# EAGLE design RS485_ISO_Sensor_unit (EAGLE 9.6.2)
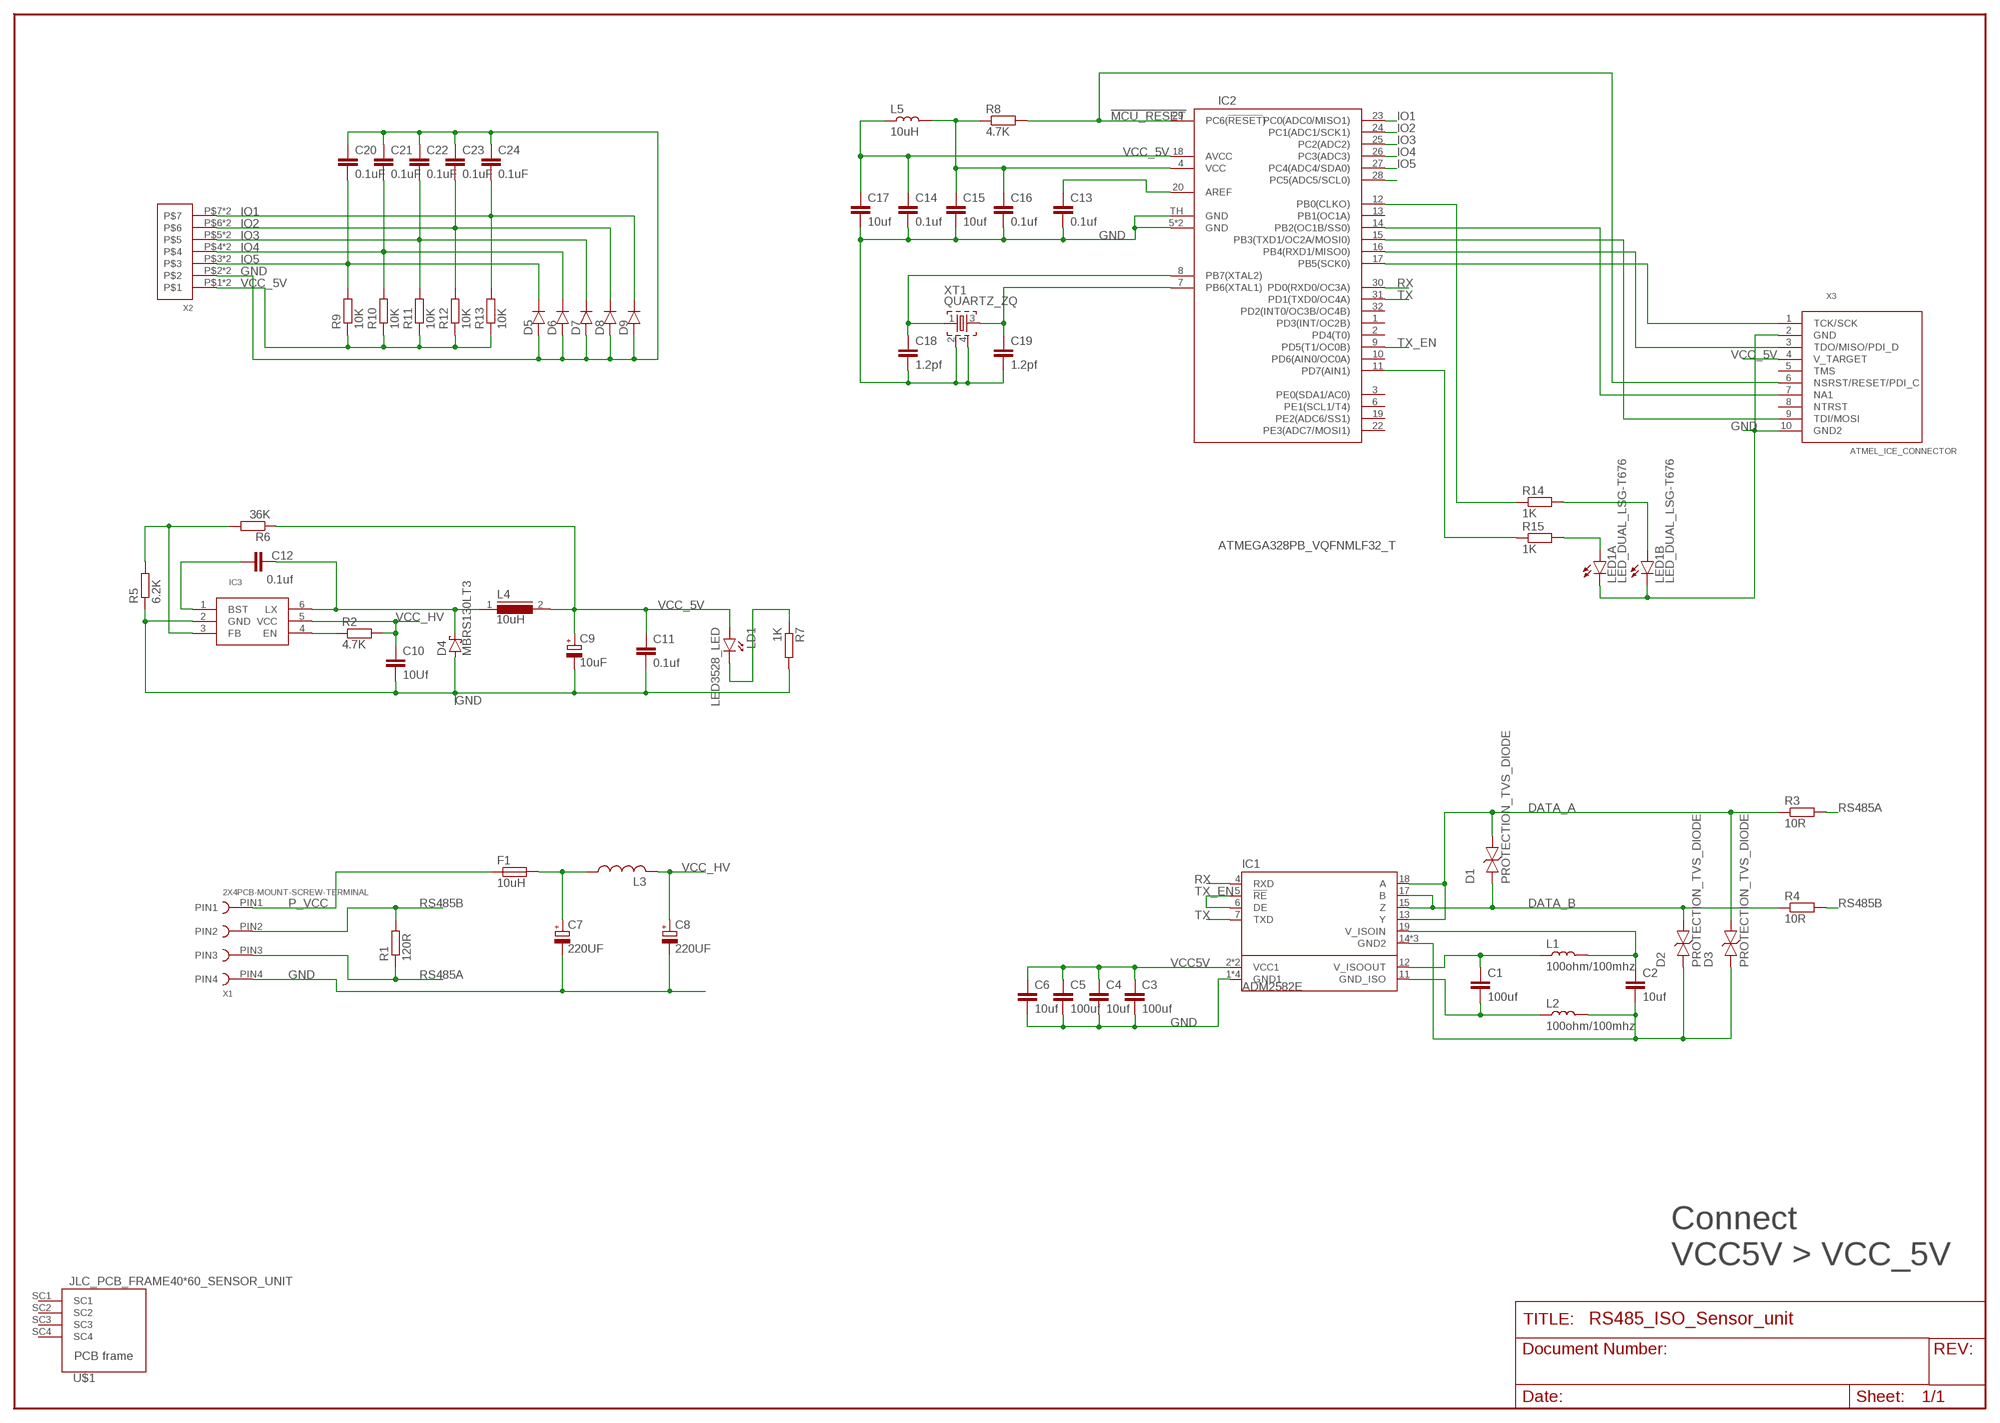
[diagram p0: schematic, sheet 1]

## Parts
C1  100uf  SMD_C0603  [0603]
C2  10uf  SMD_C0603  [0603]
C3  100uf  SMD_C0603  [0603]
C4  10uf  SMD_C0603  [0603]
C5  100uf  SMD_C0603  [0603]
C6  10uf  SMD_C0603  [0603]
C7  220UF  RADIAL_330UF_25V_8MM  [3.6MM]
C8  220UF  RADIAL_330UF_25V_8MM  [3.6MM]
C9  10uF  TANTAL_686_7343  [D/7343-31R]
C10  10Uf  SMD_C1206  [1206]
C11  0.1uf  SMD_C0603  [0603]
C12  0.1uf  SMD_C0603  [0603]
C13  0.1uf  SMD_C0603  [0603]
C14  0.1uf  SMD_C0603  [0603]
C15  10uf  SMD_C3528  [3528]
C16  0.1uf  SMD_C0603  [0603]
C17  10uf  SMD_C3528  [3528]
C18  1.2pf  SMD_C0603  [0603]
C19  1.2pf  SMD_C0603  [0603]
C20  0.1uF  SMD_C0603  [0603]
C21  0.1uF  SMD_C0603  [0603]
C22  0.1uF  SMD_C0603  [0603]
C23  0.1uF  SMD_C0603  [0603]
C24  0.1uF  SMD_C0603  [0603]
D1  PROTECTION_TVS_DIODE  [SMA403D]
D2  PROTECTION_TVS_DIODE  [SMA403D]
D3  PROTECTION_TVS_DIODE  [SMA403D]
D4  MBRS130LT3  [SMB]
D5  L1N4148WT1GSOD123_GALILE0_SMALL  [SOD-123_MINI-SMA]
D6  L1N4148WT1GSOD123_GALILE0_SMALL  [SOD-123_MINI-SMA]
D7  L1N4148WT1GSOD123_GALILE0_SMALL  [SOD-123_MINI-SMA]
D8  L1N4148WT1GSOD123_GALILE0_SMALL  [SOD-123_MINI-SMA]
D9  L1N4148WT1GSOD123_GALILE0_SMALL  [SOD-123_MINI-SMA]
F1  10uH  SMD_FUSE  [SMD_2410_FUSE_NOK]
IC1  ADM2582E  [SO20L]
IC2  ATMEGA328PB_VQFNMLF32_T  [MLF32-TH]
IC3  BD9G101G_SOT23(6)  [SOT-23(6)]
L1  100ohm/100mhz  SMD_L  [0805]
L2  100ohm/100mhz  SMD_L  [0805]
L3  L-US0207/2V  [0207/2V]
L4  10uH  DR74  [DR74]
L5  10uH  SMD_L  [0805]
LD1  LED3528_LED  [3528]
LED1  LED_DUAL_LSG-T676  [P-LCC4-0]
R1  120R  R-EU_0204/5  [0204/5]
R2  4.7K  SMD_R0603  [0603]
R3  10R  SMD_R1206  [1206]
R4  10R  SMD_R1206  [1206]
R5  6.2K  SMD_R0603  [0603]
R6  36K  SMD_R0603  [0603]
R7  1K  SMD_R0603  [0603]
R8  4.7K  SMD_R0603  [0603]
R9  10K  SMD_R0603  [0603]
R10  10K  SMD_R0603  [0603]
R11  10K  SMD_R0603  [0603]
R12  10K  SMD_R0603  [0603]
R13  10K  SMD_R0603  [0603]
R14  1K  SMD_R0603  [0603]
R15  1K  SMD_R0603  [0603]
U$1  JLC_PCB_FRAME40*60_SENSOR_UNIT  [40X60_SENSOR_UNIT]
X1  2X4PCB-MOUNT-SCREW-TERMINAL  [2X4PCB-MOUNT-SCREW-TERMINAL]
X2  WAGO250_X7  [WAGO250_FP_7X]
X3  ATMEL_ICE_CONNECTOR  [MINI10P_SPI/JTAG/PDI]
XT1  QUARTZ_ZQ  [QUARTZ_3X3MM]

## Nets
!MCU_RESET: IC2.29(PC6(!RESET!)) R8.2 X3.6(NSRST/RESET/PDI_C)
AREF: C13.1 IC2.20(AREF)
AVCC: C14.1 C17.M IC2.18(AVCC) L5.1
DATA_A: D1.P$2(C) D3.P$2(C) IC1.13(Y) IC1.18(A) R3.1
DATA_B: D1.P$1(A) D2.P$2(C) IC1.15(Z) IC1.17(B) R4.1
GND: C3.2 C4.2 C5.2 C6.2 C7.P$1(-) C8.P$1(-) C9.- C10.2 C11.2 C13.2 C14.2 C15.P C16.2 C17.P C18.2 C19.2 C20.1 C21.1 C22.1 C23.1 C24.1 D4.A D5.A D6.A D7.A D8.A D9.A IC1.1(GND1) IC1.3(GND1) IC1.9(GND1) IC1.10(GND1) IC2.5(GND) IC2.21(GND) IC2.TH(GND) IC3.2(GND) LED1.1(A:C) LED1.3(B:C) R5.1 R7.2 X1.PIN4 X2.P$2 X2.U$2 X3.2(GND) X3.10(GND2) XT1.2 XT1.4
GND2: C2.2 D2.P$1(A) D3.P$1(A) IC1.14(GND2) IC1.16(GND2) IC1.20(GND2) L2.2
IO1: C24.2 D9.C IC2.23(PC0(ADC0/MISO1)) R13.2 X2.P$7 X2.U$7
IO2: C23.2 D8.C IC2.24(PC1(ADC1/SCK1)) R12.2 X2.P$6 X2.U$6
IO3: C22.2 D7.C IC2.25(PC2(ADC2)) R11.2 X2.P$5 X2.U$5
IO4: C21.2 D6.C IC2.26(PC3(ADC3)) R10.2 X2.P$4 X2.U$4
IO5: C20.2 D5.C IC2.27(PC4(ADC4/SDA0)) R9.2 X2.P$3 X2.U$3
N$1: C7.P$2(+) F1.P$2 L3.1
N$2: IC3.4(EN) R2.1
N$3: C1.1 IC1.12(V_ISOOUT) L1.1
N$4: C2.1 IC1.19(V_ISOIN) L1.2
N$5: C1.2 IC1.11(GND_ISO) L2.1
N$6: C12.1 IC3.1(BST)
N$7: IC3.3(FB) R5.2 R6.2
N$8: C12.2 D4.C IC3.6(LX) L4.1
N$9: LED1.2(A:A) R15.2
N$10: LED1.4(B:A) R14.2
N$11: IC2.12(PB0(CLKO)) R14.1
N$12: LD1.M(K) R7.1
N$13: IC2.17(PB5(SCK0)) X3.1(TCK/SCK)
N$14: IC2.16(PB4(RXD1/MISO0)) X3.3(TDO/MISO/PDI_D)
N$15: IC2.15(PB3(TXD1/OC2A/MOSI0)) X3.9(TDI/MOSI)
N$16: IC2.11(PD7(AIN1)) R15.1
N$17: IC2.14(PB2(OC1B/SS0)) X3.7(NA1)
N$18: C18.1 IC2.8(PB7(XTAL2)) XT1.1
N$19: C19.1 IC2.7(PB6(XTAL1)) XT1.3
N$23: IC2.28(PC5(ADC5/SCL0))
P_VCC: F1.P$1 X1.PIN1
RS485A: R1.1 R3.2 X1.PIN3
RS485B: R1.2 R4.2 X1.PIN2
RX: IC1.4(RXD) IC2.30(PD0(RXD0/OC3A))
TX: IC1.7(TXD) IC2.31(PD1(TXD0/OC4A))
TX_EN: IC1.5(!RE) IC1.6(DE) IC2.9(PD5(T1/OC0B))
VCC5V: C3.1 C4.1 C5.1 C6.1 IC1.2(VCC1) IC1.8(VCC1)
VCC_5V: C9.+ C11.1 C15.M C16.1 IC2.4(VCC) L4.2 L5.2 LD1.P(A) R6.1 R8.1 R9.1 R10.1 R11.1 R12.1 R13.1 X2.P$1 X2.U$1 X3.4(V_TARGET)
VCC_HV: C8.P$2(+) C10.1 IC3.5(VCC) L3.2 R2.2
Unconnected: IC2.1(PD3(INT/OC2B)) IC2.2(PD4(T0)) IC2.3(PE0(SDA1/AC0)) IC2.6(PE1(SCL1/T4)) IC2.10(PD6(AIN0/OC0A)) IC2.13(PB1(OC1A)) IC2.19(PE2(ADC6/SS1)) IC2.22(PE3(ADC7/MOSI1)) IC2.32(PD2(INT0/OC3B/OC4B)) U$1.SC1 U$1.SC2 U$1.SC3 U$1.SC4 X3.5(TMS) X3.8(NTRST)

## Notes on the sheet
- Connect 
  VCC5V > VCC_5V

## Library data of the parts
C1-C6 C10-C24 = passive_components:SMD_C
C7 C8 = passive_components:RADIAL_330UF_25V_8MM
C9 = passive_components:TANTAL_686_7343
D1-D3 = passive_components:PROTECTION_TVS_DIODE
D4 = diode:MBRS130LT3: Schottky Power Rectifier Source: http://www.onsemi.com/pub/Collateral/MBRS130LT3-D.PDF
D5-D9 = passive_components:L1N4148WT1G
F1 = passive_components:SMD_FUSE
IC1 = my_IC:ADM2582E
IC2 = my_IC:ATMEGA328PB_VQFN
IC3 = my_IC:BD9G101G_SOT23(6)
L1 L2 L5 = passive_components:SMD_L
L3 = rcl:L-US: INDUCTOR, American symbol
L4 = inductors:DR74: High Power Density, High Efficiency, Shielded Inductors Source: coiltronics_dr_series.pdf; SPICEPREFIX: L
LD1 = passive_components:LED
LED1 = passive_components:LED_DUAL_LSG-T676: LSG T676 Hyper Multi TOPLED ® Hyper-Bright LED Source: http://docs-europe.electrocomponents.com/webdocs/08c3/0900766b808c36ca.pdf
R1 = rcl:R-EU_: RESISTOR, European symbol
R2-R15 = passive_components:SMD_R
U$1 = passive_components:JLC_PCB_FRAME
X1 = Wago_250:2X4PCB-MOUNT-SCREW-TERMINAL
X2 = Wago_250:WAGO250_X7
X3 = passive_components:ATMEL_ICE_CONNECTOR
XT1 = passive_components:QUARTZ_ZQ

## Board
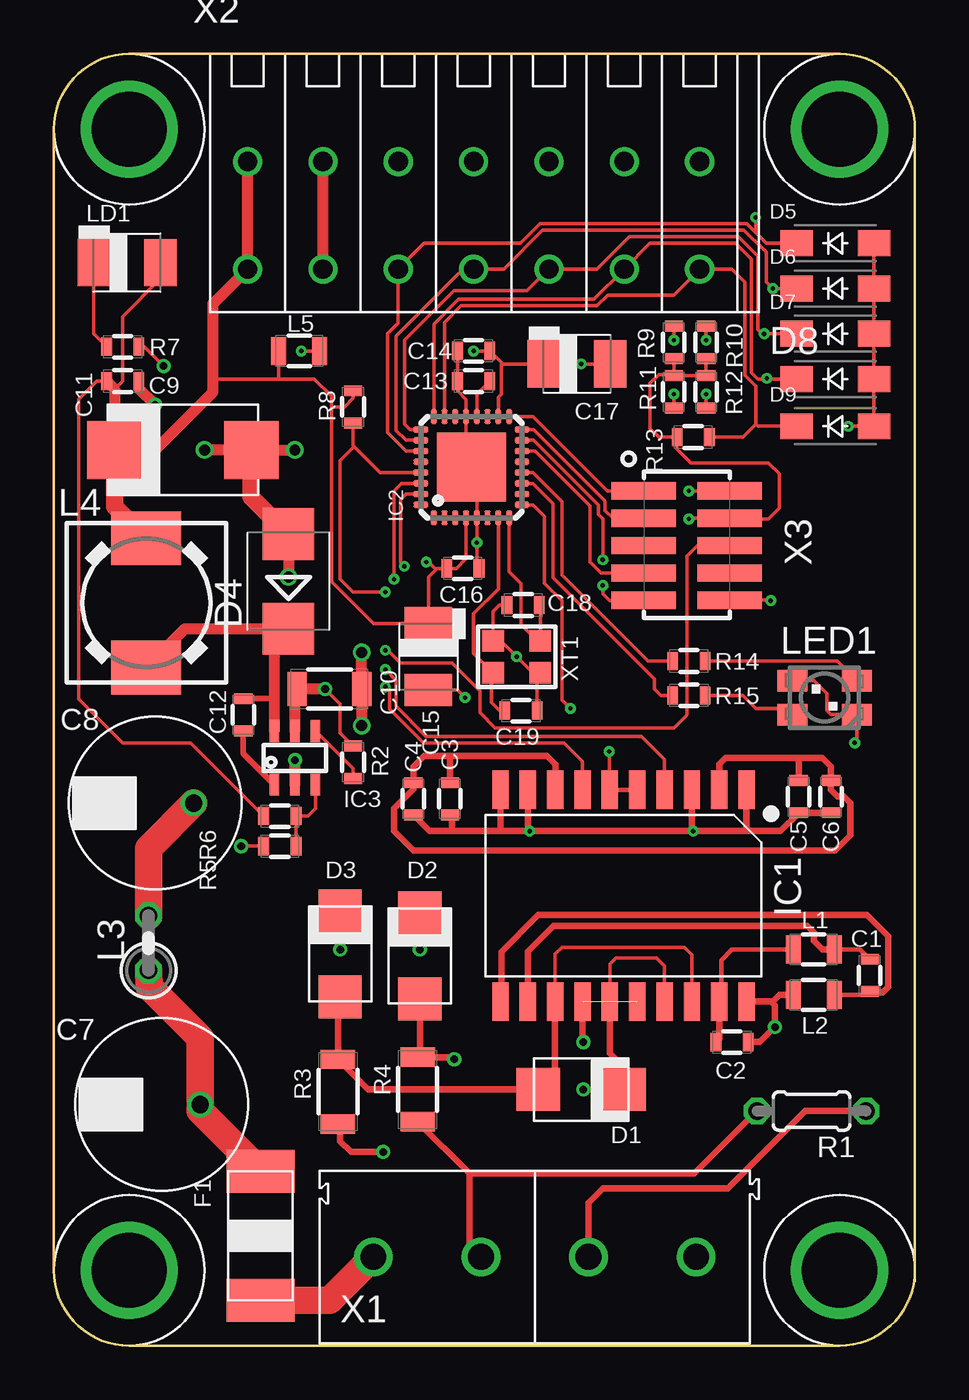
[diagram p1: board, top side]
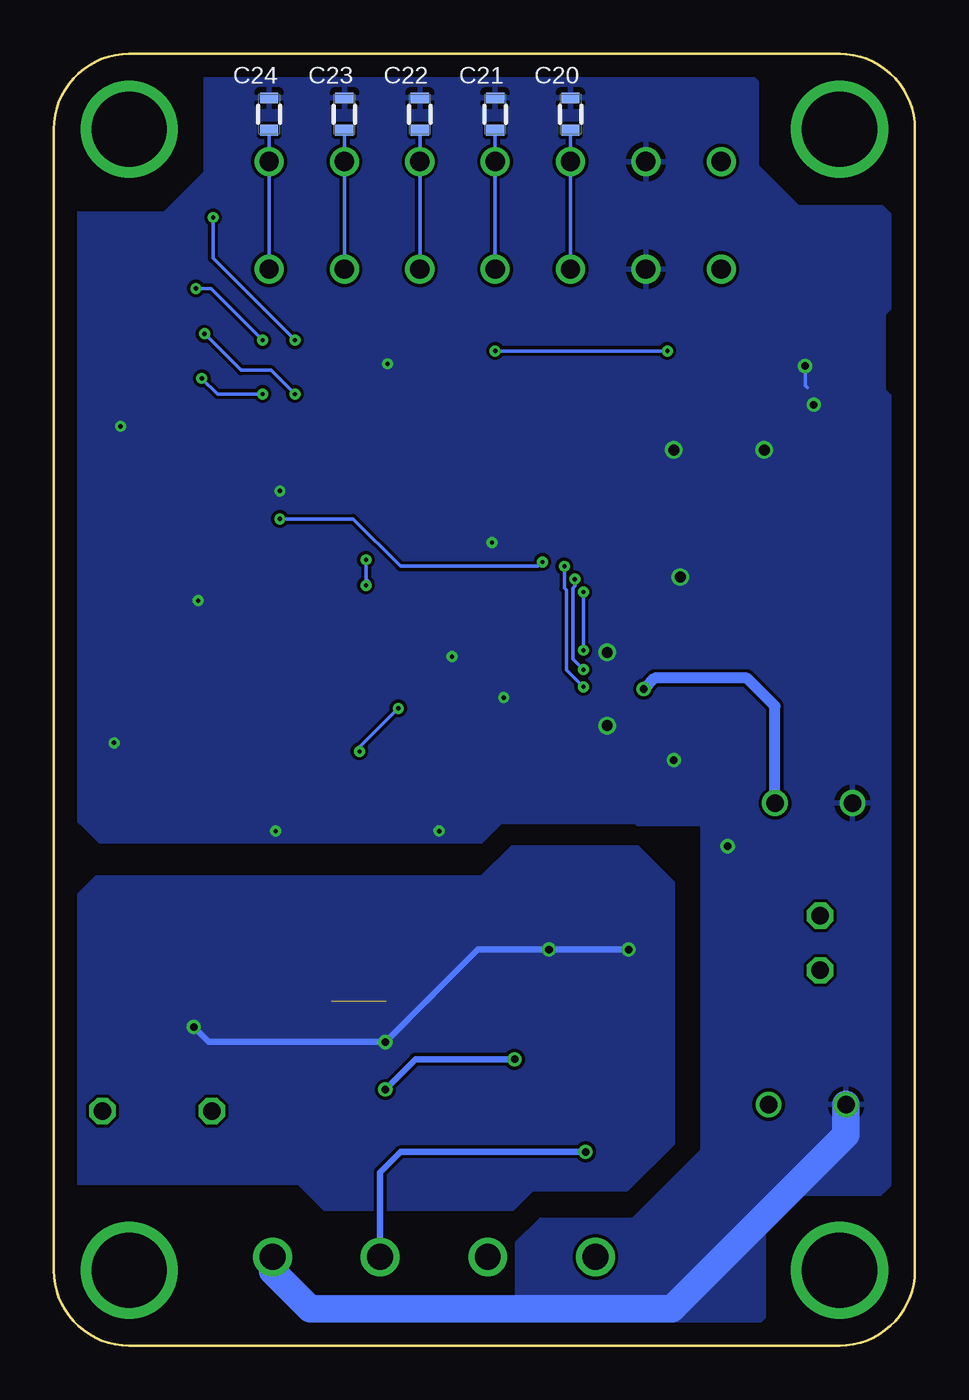
[diagram p2: board, bottom side, seen from below]

Size 40 x 60 mm. Coordinates in mm from the lower left corner, seen from the top.
Copper layers (1*16): Top 0.035mm / dielectric 1.5mm / Bottom 0.035mm
Design rules "default *": minimum track width 6mil, minimum drill 0.2mm, track to track 6mil, track to pad 6mil, pad to pad 6mil, via to via 6mil, smd to smd 6mil, copper to edge 40mil, drill to drill 6mil, minimum pad ring 6mil, minimum via ring 6mil, stop-mask expansion 4mil, vias tented up to drill 20mil, thermal gap 10mil

### Footprints (pad centres in the part's own frame; a part is rotated, then mirrored left to right if it is on the bottom)
0603 = smd 0.85 x 0.5: 1 0,0.75; 2 0,-0.75
3.6MM = drill 0.8: P$1 -1.8,0; P$2 1.8,0
D/7343-31R = smd 2.55 x 2.7: + 3.175,0; - -3.175,0
1206 = smd 1.6 x 0.9: 1 0,1.5; 2 0,-1.5
3528 = smd 1.5 x 2.2: M -1.55,0; P 1.55,0
SMA403D = smd 2 x 2: P$1 -2,0; P$2 2,0
SMB = smd 2.4 x 2.4: A 2.2,0; C -2.2,0
SOD-123_MINI-SMA = smd 1.5 x 1.2: A 1.8,0; C -1.8,0
SMD_2410_FUSE_NOK = smd 2 x 3.15: P$1 -3,0; P$2 3,0
SO20L = smd 0.762 x 1.778: 1 -5.08,-4.915; 2 -3.81,-4.915; 3 -2.54,-4.915; 4 -1.27,-4.915; 5 0,-4.915; 6 1.27,-4.915; 7 2.54,-4.915; 8 3.81,-4.915; 9 5.08,-4.915; 10 6.35,-4.915; 11 6.35,4.915; 12 5.08,4.915; 13 3.81,4.915; 14 2.54,4.915; 15 1.27,4.915; 16 0,4.915; 17 -1.27,4.915; 18 -2.54,4.915; 19 -3.81,4.915; 20 -5.08,4.915
MLF32-TH = smd 0.7 x 0.3: 1 -2.35,1.75; 2 -2.35,1.25; 3 -2.35,0.75; 4 -2.35,0.25; 5 -2.35,-0.25; 6 -2.35,-0.75; 7 -2.35,-1.25; 8 -2.35,-1.75; 17 2.35,-1.75; 18 2.35,-1.25; 19 2.35,-0.75; 20 2.35,-0.25; 21 2.35,0.25; 22 2.35,0.75; 23 2.35,1.25; 24 2.35,1.75 | smd 0.3 x 0.7: 9 -1.75,-2.35; 10 -1.25,-2.35; 11 -0.75,-2.35; 12 -0.25,-2.35; 13 0.25,-2.35; 14 0.75,-2.35; 15 1.25,-2.35; 16 1.75,-2.35; 25 1.75,2.35; 26 1.25,2.35; 27 0.75,2.35; 28 0.25,2.35; 29 -0.25,2.35; 30 -0.75,2.35; 31 -1.25,2.35; 32 -1.75,2.35 | smd 3.2 x 3.2: TH 0,0
SOT-23(6) = smd 0.45 x 1: 1 -0.95,-1.25; 2 0,-1.25; 3 0.95,-1.25; 4 0.95,1.25; 5 0,1.25; 6 -0.95,1.25
0805 = smd 1.3 x 0.7: 1 0,0.95; 2 0,-0.95
0207/2V = drill 0.813 octagon: 1 -1.27,0; 2 1.27,0
DR74 = smd 2.5 x 3.25: 1 -3,0; 2 3,0
P-LCC4-0 = smd 1 x 1.4: 1 -0.787,-1.5; 2 -0.787,1.5; 3 0.787,1.5; 4 0.787,-1.5
0204/5 = drill 0.813 octagon: 1 -2.54,0; 2 2.54,0
40X60_SENSOR_UNIT = drill 3.5: SC1 3.5,56.5; SC2 36.5,56.5; SC3 3.5,3.5; SC4 36.5,3.5
2X4PCB-MOUNT-SCREW-TERMINAL = drill 1.2: PIN1 0,2.5; PIN2 0,-2.5; PIN3 0,-7.5; PIN4 0,-12.5
WAGO250_FP_7X = drill 0.9: P$1 0,5; P$2 3.5,5; P$3 7,5; P$4 10.5,5; P$5 14,5; P$6 17.5,5; P$7 21,5; U$1 0,0; U$2 3.5,0; U$3 7,0; U$4 10.5,0; U$5 14,0; U$6 17.5,0; U$7 21,0
MINI10P_SPI/JTAG/PDI = smd 0.8 x 3: 1 0,-4; 2 0,0; 3 1.27,-4; 4 1.27,0; 5 2.54,-4; 6 2.54,0; 7 3.81,-4; 8 3.81,0; 9 5.08,-4; 10 5.08,0
QUARTZ_3X3MM = smd 1 x 1: 1 -0.75,1.1; 2 0.75,1.1; 3 0.75,-1.1; 4 -0.75,-1.1

### Placement (x,y rotation side)
C1  37.9,17.2 0 top
C2  31.5,14.1 90 top
C3  18.4,25.4 0 top
C4  16.7,25.4 0 top
C5  34.6,25.5 0 top
C6  36.1,25.5 0 top
C7  5,11.2 0 top
C8  4.7,25.2 0 top
C9  6,41.6 180 top
C10  12.8,30.5 90 top
C11  3.2,44.8 90 top
C12  8.8,29.3 180 top
C13  19.5,44.8 270 top
C14  19.5,46.2 270 top
C15  17.4,32 270 top
C16  19,36.1 90 top
C17  24.3,45.6 0 top
C18  21.8,34.4 270 top
C19  21.7,29.5 90 top
C20  16,57.2 0 bottom
C21  19.5,57.2 0 bottom
C22  23,57.2 0 bottom
C23  26.5,57.2 0 bottom
C24  30,57.2 0 bottom
D1  24.5,11.9 180 top
D2  17,18.1 270 top
D3  13.3,18.2 270 top
D4  10.9,35.5 90 top
D5  36.3,51.2 0 top
D6  36.3,49.1 0 top
D7  36.3,47 0 top
D8  36.3,44.9 0 top
D9  36.3,42.7 0 top
F1  9.6,5.1 90 top
IC1  27.1,20.9 180 top
IC2  19.4,40.8 90 top
IC3  11.2,27.3 0 top
L1  35.3,18.4 270 top
L2  35.3,16.3 270 top
L3  4.4,18.7 90 top
L4  4.3,34.5 90 top
L5  11.4,46.2 270 top
LD1  3.4,50.3 0 top
LED1  35.8,30.1 90 top
R1  35.2,10.9 180 top
R2  13.9,27.1 180 top
R3  13.2,11.8 0 top
R4  16.9,11.9 0 top
R5  10.5,23.2 90 top
R6  10.5,24.6 90 top
R7  3.2,46.4 90 top
R8  13.9,43.6 0 top
R9  28.8,46.6 180 top
R10  30.3,46.6 180 top
R11  28.8,44.3 0 top
R12  30.3,44.3 0 top
R13  29.7,42.2 90 top
R14  29.5,31.8 90 top
R15  29.5,30.2 90 top
U$1  0,0 0 top
X1  17.34,4.12 90 top
X2  9,50 0 top
X3  31.4,39.7 270 top
XT1  21.5,32 270 top

### Tracks (layer width: path | path; a pad name or v marks a point on that pad's centre or on a via)
!MCU_RESET  (via drill 0.2 pad 0.35)
  Top 0.152: IC2.29 15.15,40.55 13.95,41.75 | 13.95,41.75 13.9,41.8 R8.2 | v15.4,32.3 15.5,32.3 16.1,31.7 18.5,31.7 19.8,30.4 19.8,29.4 20.5,28.7 28.81,28.7 29.41,29.3 29.41,36.67 29.9,37.16 X3.6 | v15.4,35 13.9,35 13.3,35.6 13.3,41.1 13.95,41.75
  Bottom 0.152: v15.4,32.3 v15.4,35
AREF
  Top 0.152: IC2.20 19.65,44.2 C13.1
AVCC  (via drill 0.2 pad 0.35)
  Top 0.152: IC2.18 20.65,44.05 20.8,44.2 20.8,45.65 | 20.8,45.65 C14.1 v19.5,46.2 | C17.M 20.85,45.6 20.8,45.65 | L5.1 v11.5,46.2
  Bottom 0.152: 19.4,46.1 v19.5,46.2 v11.5,46.2
DATA_A
  Top 0.152: IC1.13 23.29,18.19 23.6,18.5 29.3,18.5 29.64,18.16 IC1.18
  Top 0.305: IC1.13 23.29,12.69 D1.P$2 14.6,11.9 R3.1 13.2,16.1 D3.P$2
DATA_B  (via drill 0.35)
  Top 0.152: IC1.15 25.83,17.73 26.1,18 28,18 28.37,17.63 IC1.17
  Top 0.305: IC1.15 25.83,13.57 26.5,12.9 D1.P$1 v24.6,11.9 | D2.P$2 17,13.5 R4.1 18.5,13.4 v18.6,13.3
  Bottom 0.305: v18.6,13.3 23.2,13.3 v24.6,11.9
GND  (via drill 0.2, 0.2 pad 0.35, 0.35, 0.5)
  Top 0.152: R5.1 v8.7,23.2 | R7.2 4.2,46.4 v5.1,45.5 | C18.2 20.7,34.4 20.4,34.1 XT1.4 20.75,32.75 v21.5,32 22.25,31.25 XT1.2 22.45,31.1 C19.2 | C16.2 19.65,36.2 v19.65,37.3 IC2.5 19.65,40.55 IC2.TH 19.15,41.05 IC2.21 19.15,43.95 18.75,44.35 C13.2 C14.2 | C15.P 18.75,30.45 v19.1,30.1 | C17.P v24.5,45.6 | X3.2 v29.5,39.7 | X3.10 33.28,34.62 v33.3,34.6 | D5.A D6.A D7.A D8.A D9.A v36.9,42.7 | LED1.3 35.31,30.89 35.9,30.3 35.9,29.5 36.09,29.31 LED1.1 37.3,28.1 v37.2,28
  Top 0.305: 32.25,25.89 IC1.1 32.18,24.02 32.3,23.9 | C6.2 C5.2 33.75,23.9 32.3,23.9 | C4.2 17.45,23.9 18.5,23.9 | 32.3,23.9 v29.7,23.9 | v29.7,23.9 v22.1,23.9 | v22.1,23.9 20.8,23.9 | 20.8,23.9 18.5,23.9 | C3.2 18.5,24.55 18.5,23.9 | IC1.10 20.75,23.95 20.8,23.9 | IC1.9 22.02,23.98 v22.1,23.9 | IC1.3 29.64,23.96 v29.7,23.9
  Top 0.508: v14.3,32.2 C10.2 v14.3,28.8 | D4.A v10.9,35.7 | v7,41.6 C9.- v11.2,41.6 | IC3.2 v11.2,27.2 | C11.2 3.95,44.45 v4.7,43.7 | X2.U$2 X2.P$2
  Top 0.813: D4.A 9.18,39.42 C9.-
  Bottom 0.152: v5.1,45.5 5.1,44.6 5,44.5
  Bottom 1.27: X1.PIN4 29.84,3.45 28.1,1.71 11.29,1.71 3.2,9.8 C7.P$1
  pour Bottom: 18.5,0.6 18.5,4.8 17.4,5.9 13.1,5.9 9.9,9.1 9.9,27.2 9.5,27.6 0.7,27.6 0.7,7.9 1.4,7.2 1.6,7 4.7,7 5.5,7 7,5.5 7,1.3 7.8,0.5 18.4,0.5
  pour Bottom: 1.1,25.2 1.1,28.3 0.4,29 0.4,43.4 1.9,44.9 11,44.9 13.9,42 13.9,37.8 15.4,36.3 15.5,36.3 15.5,26.8 12.9,24.2 2.1,24.2
  pour Bottom: 1.4,44.1 1.4,47.9 0.8,48.5 0.8,52.2 1.5,52.9 5.4,52.9 7.3,54.8 7.3,58.7 8.3,59.7 32.2,59.7 33,58.9 33,54.5 34.9,52.6 39.6,52.6 39.6,25.1 37.9,23.4 20.1,23.4 19.2,24.3 12.9,24.3 12.9,42.5 11.9,43.5 11.9,44.1
GND2  (via drill 0.35)  (1 unrouted)
  Top 0.203: 32.2,16 IC1.20
  Top 0.305: D3.P$1 v13.3,18.4 | v24.6,14.1 24.56,14.14 IC1.14 | D2.P$1 v17,18.4 | 32.25,15.91 IC1.20 33.31,15.98 33.35,15.95 | C2.2 32.8,14.1 v33.5,14.8 33.5,15.8 33.35,15.95 | L2.2 33.7,16.3 33.35,15.95
  Bottom 0.305: v13.3,18.4 v17,18.4 20.3,18.4 v24.6,14.1 32.8,14.1 v33.5,14.8
  pour Bottom: 27.4,6.4 18.7,6.4 17.8,7.3 13.4,7.3 11.3,9.4 11.3,21.5 12.9,23.1 18.7,23.1 20.1,21.7 38,21.7 39.7,20 39.7,8.4 38.9,7.6 28.6,7.6
IO1
  Top 0.152: IC2.23 18.15,47.52 18.93,48.3 25.23,48.3 25.73,48.8 28.8,48.8 X2.U$7 31.49,50 32.09,49.4 32.09,45.08 32.6,44.57 32.6,42.8 | 32.6,42.8 32.7,42.7 D9.C | R13.2 32,42.2 32.6,42.8
  Bottom 0.152: X2.U$7 X2.P$7 C24.2
IO2  (via drill 0.2 pad 0.35)
  Top 0.152: IC2.24 17.65,47.45 18.8,48.6 25.1,48.6 X2.U$6 27.7,51.2 31.67,51.2 32.4,50.47 32.4,47.07 32.4,45.2 32.7,44.9 33.1,44.9 | 33.1,44.9 D8.C | R12.2 v30.3,44.2 | v33.12,44.92 33.1,44.9
  Bottom 0.152: X2.U$6 X2.P$6 C23.2 | v30.3,44.2 32.4,44.2 v33.12,44.92
IO3  (via drill 0.2 pad 0.35)
  Top 0.152: IC2.25 16.55,42.55 16.3,42.8 16.3,46.7 18.6,49 21.97,49 22.98,50 X2.U$5 25.22,50 26.73,51.51 31.8,51.51 32.7,50.6 32.7,47.2 32.9,47 v33,47 D7.C | R11.2 v28.8,44.2
  Bottom 0.152: X2.U$5 X2.P$5 C22.2 | v28.8,44.2 29.9,45.3 31.3,45.3 v33,47
IO4  (via drill 0.2 pad 0.35)
  Top 0.152: IC2.26 16.35,42.05 15.9,42.5 15.9,46.9 19,50 X2.U$4 20.9,50 22.71,51.81 32.06,51.81 32.97,50.9 33,50.9 33.1,50.8 33.1,49.4 v33.4,49.1 D6.C | R10.2 v30.3,46.7
  Bottom 0.152: X2.U$4 X2.P$4 C21.2 | v30.3,46.7 32.7,49.1 v33.4,49.1
IO5  (via drill 0.2 pad 0.35)
  Top 0.152: IC2.27 16.35,41.55 15.5,42.4 15.5,47 16,47.5 X2.U$3 17.2,51.2 21.67,51.2 22.58,52.11 32.19,52.11 32.6,51.7 | D5.C 33.1,51.2 32.6,51.7 | R9.2 v28.8,46.7 | v32.6,52.4 32.6,51.7
  Bottom 0.152: X2.U$3 X2.P$3 C20.2 | v28.8,46.7 32.6,50.5 v32.6,52.4
N$1
  Top 1.27: F1.P$2 6.8,10.9 C7.P$2 6.8,14.3 4.43,16.67 L3.1
N$2
  Top 0.152: IC3.4 13.9,26.8 R2.1
N$3
  Top 0.203: L1.1 37.45,18.4 C1.1
  Top 0.305: IC1.12 22.02,18.32 23.2,19.5 35,19.5 35.3,19.2 35.3,18.8 35.7,18.4 L1.1
N$4
  Top 0.203: L1.2 31.5,18.4 31,17.9 31,16.09 30.91,16 IC1.19
  Top 0.305: IC1.19 30.91,14.26 C2.1
N$5
  Top 0.203: L2.1 37.75,16.3 37.85,16.4 C1.2
  Top 0.305: IC1.11 20.8,16.04 20.8,18.3 22.5,20 37.77,20 38.77,19 38.77,16.67 38.5,16.4 37.85,16.4
N$6
  Top 0.254: IC3.1 8.8,27.5 C12.1
N$7
  Top 0.152: IC3.3 12.15,24.95 11.8,24.6 R6.2 R5.2
N$8
  Top 0.254: C12.2 10.2,30.05 10.25,30.1
  Top 0.508: IC3.6 10.25,30.1 10.25,32.65 D4.C 6.1,33.3 L4.1
N$9
  Top 0.152: LED1.2 34.01,29.6 32.6,29.6 32,30.2 R15.2
N$10
  Top 0.152: LED1.4 36.39,31.8 R14.2
N$11
  Top 0.152: IC2.12 22.25,40.55 23.59,39.2 23.59,35.8 27.6,31.8 R14.1
N$12
  Top 0.152: R7.1 1.85,47 LD1.M
N$13
  Top 0.152: IC2.17 22.26,43.15 25.71,39.7 X3.1
N$14
  Top 0.152: IC2.16 22.28,42.55 25.61,39.23 25.61,38.8 25.97,38.43 X3.3
N$15  (via drill 0.2 pad 0.35)
  Top 0.152: IC2.15 22.28,42.05 25.3,39.03 25.3,38.6 25.5,38.4 v25.5,36.5 | X3.9 27.38,34.6 25.8,34.6 25.5,34.9 v25.5,35.31
  Bottom 0.152: v25.5,36.5 25.5,35.61 25.35,35.46 v25.5,35.31
N$16
  Top 0.152: IC2.11 22.25,40.05 23.19,39.11 23.19,35.67 27.9,30.97 27.9,30.5 28.2,30.2 R15.1
N$17
  Top 0.152: IC2.14 22.35,41.55 24.9,39 24.9,36.4 25.41,35.89 X3.7
N$18
  Top 0.152: C18.1 22.6,34.35 XT1.1 22.45,32.75 21.7,33.5 21.7,35.4 21.15,35.95 IC2.8
N$19
  Top 0.152: IC2.7 20.65,35.15 19.5,34 19.5,32.15 20.32,31.32 | 20.32,31.32 XT1.3 | C19.1 20.7,29.5 20.32,29.88 20.32,31.32
P_VCC
  Top 1.27: X1.PIN1 12.82,2.1 F1.P$1
RS485A  (via drill 0.35)
  Top 0.305: X1.PIN3 24.84,6.64 25.5,7.3 31.3,7.3 34.9,10.9 R1.1 | R3.2 13.3,10.2 13.3,9.5 13.8,9 v15.3,9
  Bottom 0.305: v15.3,9 23.9,9 24.84,8.06 X1.PIN3
RS485B
  Top 0.305: R4.2 19.3,8 | R1.2 29.76,8 19.3,8 | 19.3,8 19.3,4.66 X1.PIN2
RX  (via drill 0.2 pad 0.35)
  Top 0.152: IC2.30 16.15,40.05 15.8,39.7 v15.8,35.6 | v15.4,31.4 15.9,30.9 15.9,29.7 17.3,28.3 27.3,28.3 28.37,27.23 IC1.4
  Bottom 0.152: v15.8,35.6 15.8,35.28 15.88,35.2 15.88,31.88 v15.4,31.4
TX  (via drill 0.2 pad 0.35)
  Top 0.152: IC2.31 16.35,39.55 16.11,39.3 16.11,36.38 v16.28,36.2 | v15.4,30.6 15.6,30.41 15.6,29.57 17.17,28 23.7,28 24.56,27.14 IC1.7
  Bottom 0.152: v16.28,36.2 16.28,35.18 16.19,35.09 16.19,31.39 v15.4,30.6
TX_EN  (via drill 0.2 pad 0.35)
  Top 0.152: IC2.9 22.25,39.05 22.8,38.5 22.8,35.4 23.6,34.6 23.6,30 v24,29.6 | v25.8,27.6 25.8,25.91 25.9,25.82
  Top 0.203: IC1.6 25.9,25.82 IC1.5
  Bottom 0.152: v24,29.6 25.8,27.8 v25.8,27.6
VCC5V
  Top 0.305: 30.75,25.98 IC1.2 30.91,27.01 31.2,27.3 34.6,27.3 | 34.6,27.3 35.7,27.3 36.1,26.9 C6.1 36.1,25.8 36.4,25.5 36.7,25.5 37,25.2 37,23.7 36.3,23 16.7,23 15.8,23.9 15.8,24.95 16.7,25.85 C4.1 16.7,26.9 17.2,27.4 18.4,27.4 | 34.6,27.3 C5.1 | IC1.8 23.3,25.82 23.3,27 22.9,27.4 18.4,27.4 | C3.1 18.4,27.4
VCC_5V  (via drill 0.2 pad 0.35)
  Top 0.152: R6.1 6.35,28 3.2,28 1.16,30.04 1.16,43.96 2,44.8 C11.1 | LD1.P 4.95,49.55 3.2,47.8 3.2,44.8 2.83,44.42 | IC2.4 19.15,36.55 18.7,36.1 C16.1 17.8,36.1 17.75,36.05 | 17.75,36.05 17.4,35.7 C15.M 14.85,33.55 12.9,35.5 12.9,43.6 | 10.5,46.15 L5.2 10.45,44.95 10.5,44.9 | 10.5,44.9 12.1,44.9 12.9,44.1 12.9,43.6 | 10.5,44.9 7.4,44.9 | 12.9,43.6 13.5,43.6 13.9,44 R8.1 | v29.5,38.4 29.53,38.43 X3.4 31.43,38.4 33.2,38.4 33.7,38.9 33.7,40.5 33.2,41 29.6,41 28.95,41.65 R13.1 28.1,42.2 27.7,42.6 27.7,44.7 28.1,45.1 28.75,45.1 R11.1 | v17.3,36.4 17.4,36.4 17.75,36.05 | R11.1 R12.1 R10.1 | R11.1 R9.1
  Top 0.508: C11.1 2.83,44.42 2.83,41.3 | C9.+ 2.92,41.7 4.8,41.7 7.4,44.3 7.4,44.9 7.4,48.4 X2.U$1 X2.P$1
  Top 0.813: L4.2 2.83,38.98 2.83,41.3 C9.+
  Bottom 0.152: v29.5,38.4 26.1,38.4 23.9,36.2 17.5,36.2 v17.3,36.4
VCC_HV  (via drill 0.35)
  Top 0.152: R2.2 13.3,28.45 13.3,29.8 v12.6,30.5
  Top 0.508: IC3.5 11.2,30.4 C10.1 v12.6,30.5
  Top 1.27: L3.2 4.4,23.1 C8.P$2
  Bottom 0.508: C8.P$2 6.5,29.7 7.8,31 12.1,31 v12.6,30.5